# Altium schematic sheet StarterMotor.SchDoc
size A
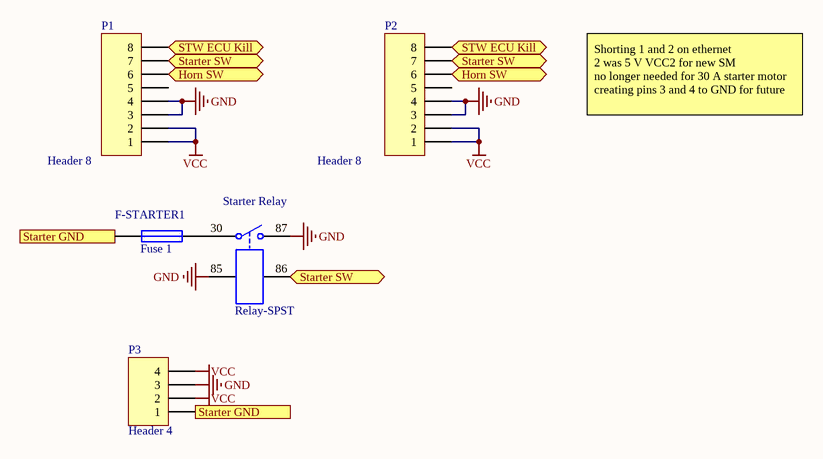
[diagram p0: StarterMotor.SchDoc]

## Parts
F-STARTER1  Fuse 1  [SML FUSE HOLDER]
P1  Header 8  [RJHSE-5080]
P2  Header 8  [RJHSE-5080]
P3  Header 4  [4-PIN Molex]
Starter_Relay  Relay-SPST  [Automotive Relay]

## Ports
Horn SW (bidir), Starter GND (out), Starter SW (bidir), STW ECU Kill (bidir)

## Nets
GND: P1.3 P1.4 P2.3 P2.4 P3.3 Starter_Relay.85 Starter_Relay.87
VCC: P1.1 P1.2 P2.1 P2.2 P3.2 P3.4
Horn SW: P1.6 P2.6 ; port Horn SW
Starter GND: F-STARTER1.1 P3.1 ; port Starter GND
Starter SW: P1.7 P2.7 Starter_Relay.86 ; port Starter SW
STW ECU Kill: P1.8 P2.8 ; port STW ECU Kill
NetF-STARTER1_2: F-STARTER1.2 Starter_Relay.30

Not connected (* = marked no-connect by the designer): P1 5; P2 5

## Notes on the sheet
- Shorting 1 and 2 on ethernet
  2 was 5 V VCC2 for new SM
  no longer needed for 30 A starter motor
  creating pins 3 and 4 to GND for future

## Library data of the parts
F-STARTER1 = Fuse 1: Fuse; Published: 8-Jun-2000; LatestRevisionDate: 17-Jul-2002; LatestRevisionNote: Re-released for DXP Platform.; PackageReference: PIN-W2/E2.8; Publisher: Altium Limited; PackageDescription: Thru-Hole; 2 Leads
P1 P2 = Header 8: Header, 8-Pin; LatestRevisionDate: 17-Jul-2002; LatestRevisionNote: Re-released for DXP Platform.; Publisher: Altium Limited
P3 = Header 4: Header, 4-Pin; LatestRevisionDate: 17-Jul-2002; LatestRevisionNote: Re-released for DXP Platform.; Publisher: Altium Limited
Starter_Relay = Relay-SPST: Single-Pole Single-Throw Relay; Published: 24-Mar-1999; LatestRevisionDate: 17-Jul-2002; LatestRevisionNote: Re-released for DXP Platform.; PackageReference: MODULE4; Publisher: Altium Limited